# EAGLE schematic ac-analyser (EAGLE 9.6.2)
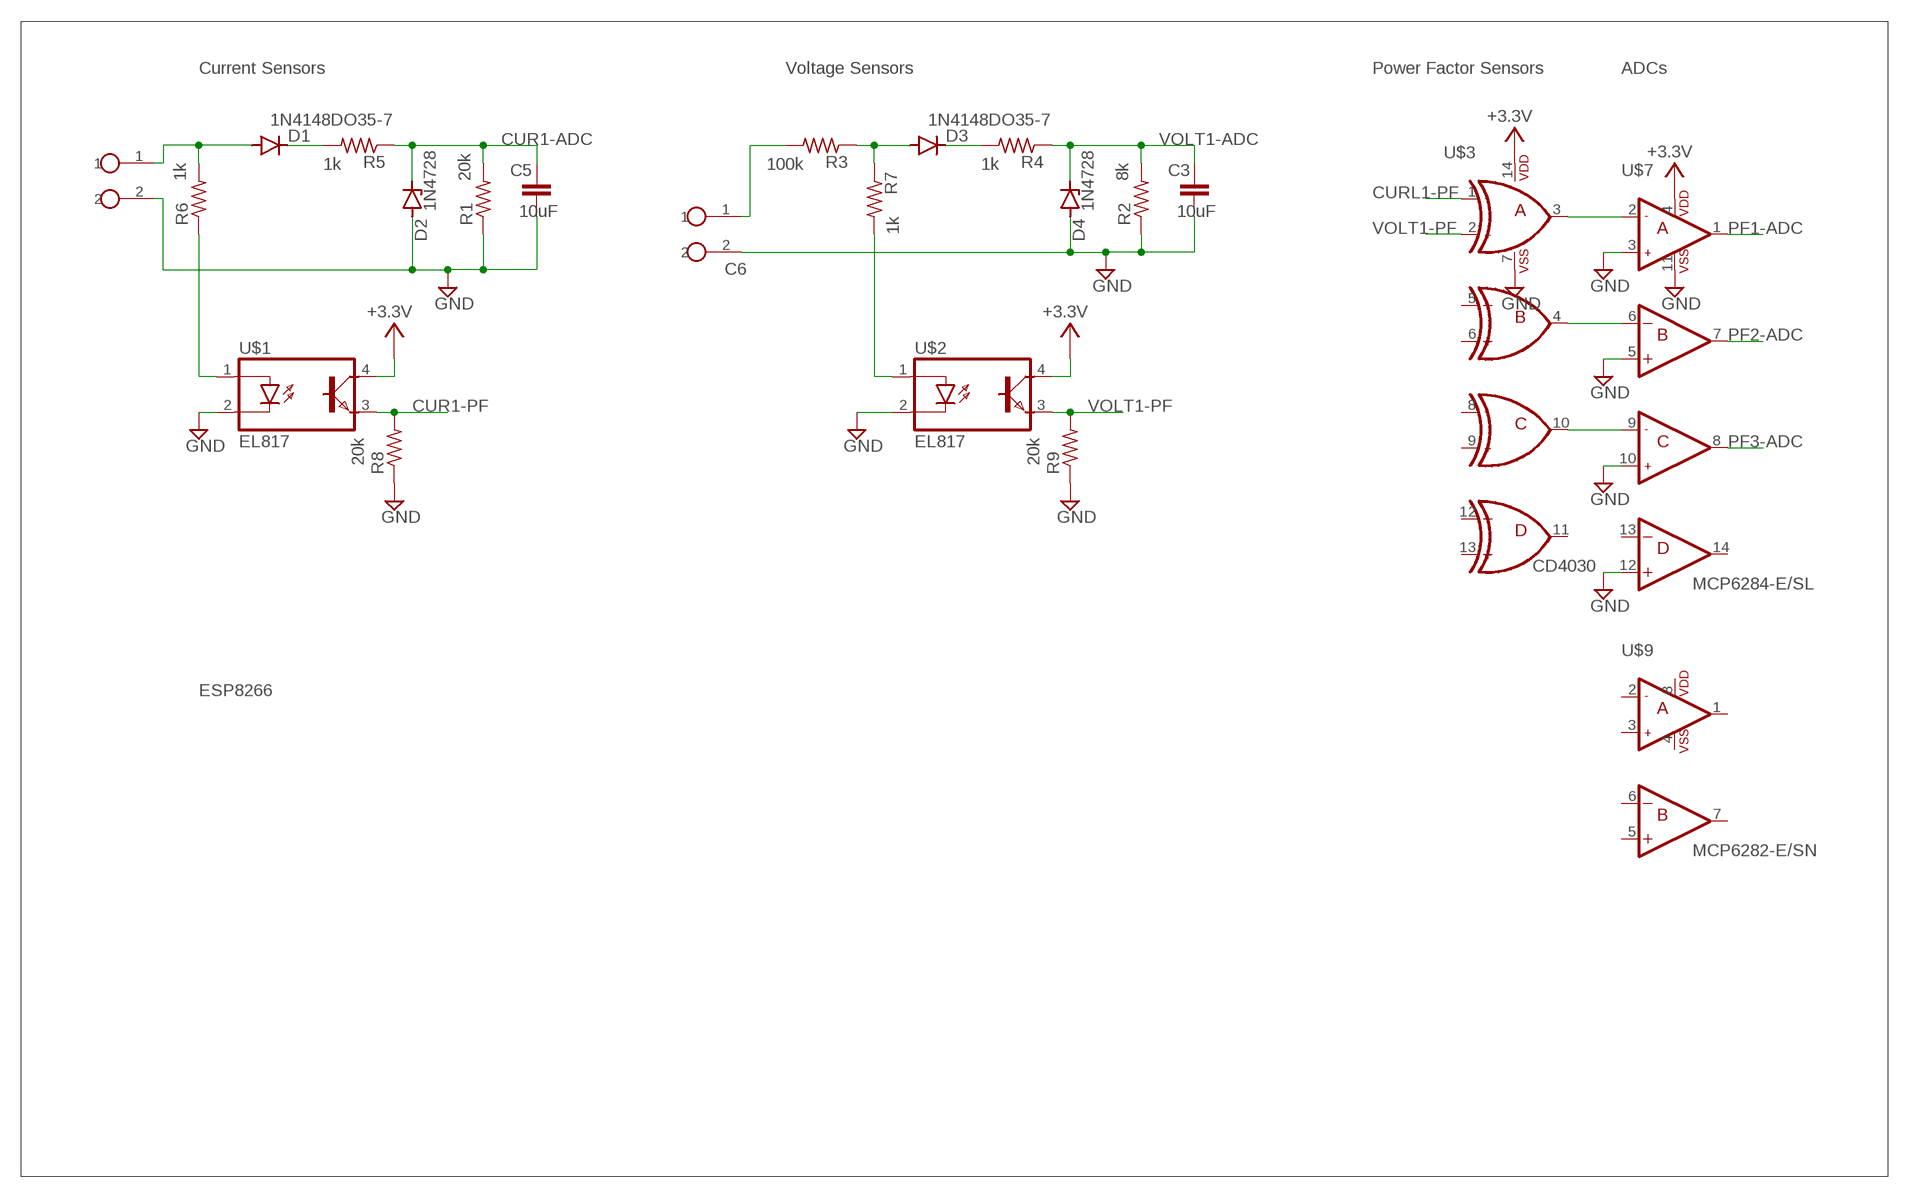
[diagram p0: schematic, sheet 1]

## Parts
C1  CONNECTOR-2PINSCREW-SMALL  [CONNECTOR-2PIN-5MM]
C3  10uF  C2.5/4  [C2.5-4]
C5  10uF  C2.5/4  [C2.5-4]
C6  CONNECTOR-2PINSCREW-SMALL  [CONNECTOR-2PIN-5MM]
D1  1N4148DO35-7  [DO35-7]
D2  1N4728  [DO41Z10]
D3  1N4148DO35-7  [DO35-7]
D4  1N4728  [DO41Z10]
R1  20k  RESISTORV1  [RESISTOR-V1]
R2  8k  RESISTORV1  [RESISTOR-V1]
R3  100k  RESISTORV1  [RESISTOR-V1]
R4  1k  RESISTORV1  [RESISTOR-V1]
R5  1k  RESISTORV1  [RESISTOR-V1]
R6  1k  RESISTORV1  [RESISTOR-V1]
R7  1k  RESISTORV1  [RESISTOR-V1]
R8  20k  RESISTORV1  [RESISTOR-V1]
R9  20k  RESISTORV1  [RESISTOR-V1]
U$1  EL817  [DIP-4PIN]
U$2  EL817  [DIP-4PIN]
U$3  CD4030  [PDIP-14PIN]
U$7  MCP6284-E/SL  [PDIP-14PIN]
U$9  MCP6282-E/SN  [PDIP-8PIN]

## Nets
+3.3V: U$1.4(COLLECTOR) U$2.4(COLLECTOR) U$3.14(VDD) U$7.4(VDD)
A: C1.1 D1.A R6.2
CUR1-ADC: C5.1 D2.C R1.2 R5.1
CUR1-PF: R8.2 U$1.3(EMITTER)
CURL1-PF: U$3.1(INA1)
GND: C1.2 C3.2 C5.2 C6.2 D2.A D4.A R1.1 R2.1 R8.1 R9.1 U$1.2(CATHODE) U$2.2(CATHODE) U$3.7(VSS) U$7.3(INA+) U$7.5(INB+) U$7.10(INC+) U$7.11(VSS) U$7.12(IND+)
N$1: R6.1 U$1.1(ANODE)
N$2: D1.C R5.2
N$3: R7.2 U$2.1(ANODE)
N$4: C6.1 R3.2
N$5: U$3.3(OUTA) U$7.2(INA-)
N$6: U$3.4(OUTB) U$7.6(INB-)
N$7: U$3.10(OUTC) U$7.9(INC-)
N$8: D3.C R4.2
PF1-ADC: U$7.1(OUTA)
PF2-ADC: U$7.7(OUTB)
PF3-ADC: U$7.8(OUTC)
V1: D3.A R3.1 R7.1
VOLT1-ADC: C3.1 D4.C R2.2 R4.1
VOLT1-PF: R9.2 U$2.3(EMITTER) U$3.2(INA2)
Unconnected: U$3.5(INB1) U$3.6(INB2) U$3.8(INC1) U$3.9(INC2) U$3.11(OUTD) U$3.12(IND1) U$3.13(IND2) U$7.13(IND-) U$7.14(OUTD) U$9.1(OUTA) U$9.2(INA-) U$9.3(INA+) U$9.5(INB+) U$9.6(INB-) U$9.7(OUTB)

## Notes on the sheet
- Current Sensors | Voltage Sensors | Power Factor Sensors | ADCs
- ESP8266

## Power pins joined to a net without a drawn wire
VDD: U$9.8(VDD)
VSS: U$9.4(VSS)

## Library data of the parts
C1 C6 = stutz-components-library:CONNECTOR-2PIN; MPN: 5442222
C3 C5 = capacitor-wima:C: CAPACITOR naming: grid - package width
D1 D3 = diode:1N4148: DIODE high speed (Philips)
D2 D4 = diode:1N4728: Z DIODE 3.3 V, 1W, 5 percent
R1-R9 = stutz-components-library:RESISTOR
U$1 U$2 = stutz-components-library:EL817
U$3 = stutz-components-library:CD4030
U$7 = stutz-components-library:MCP6284-E/SL
U$9 = stutz-components-library:MCP6282-E/SN